# EAGLE design amirgb2vga (EAGLE 9.2.0)
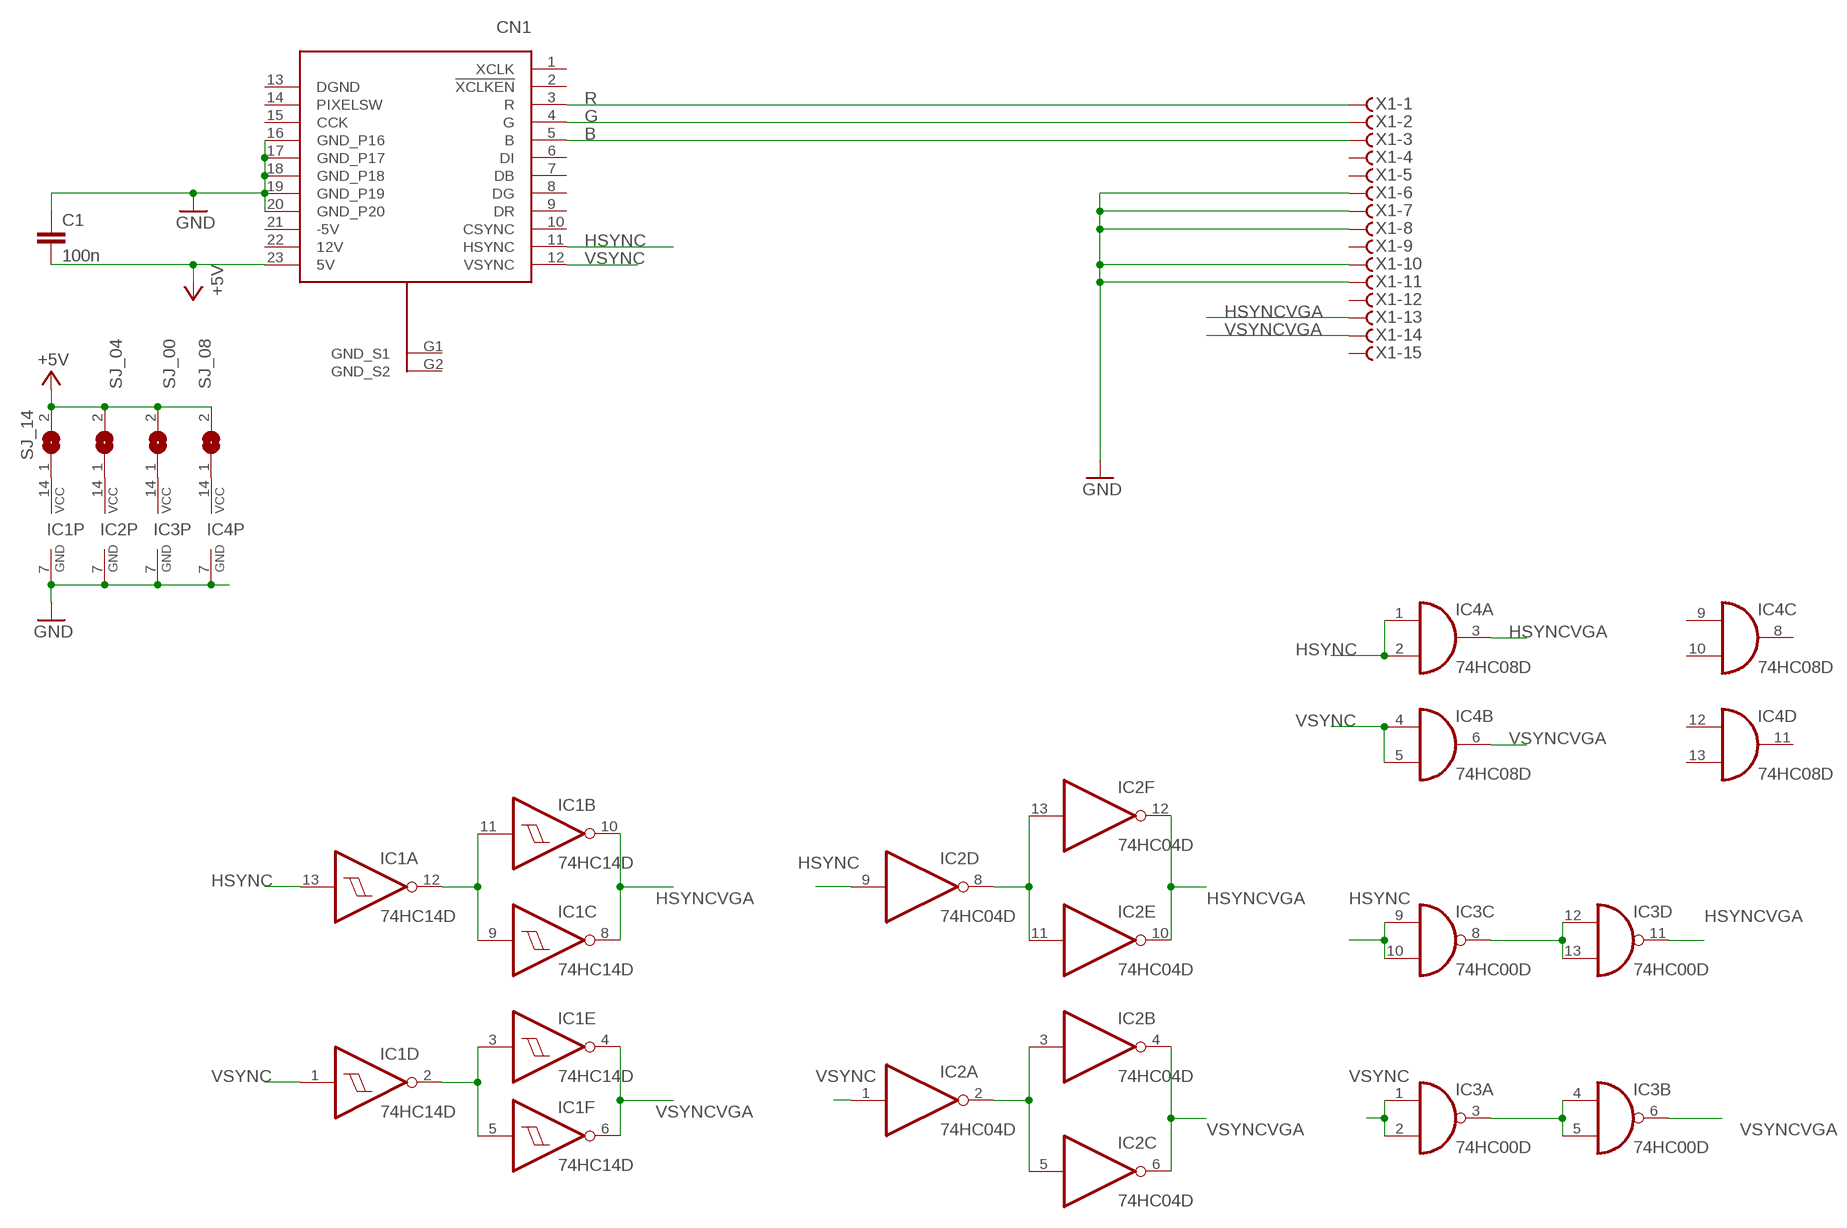
[diagram p0: schematic, sheet 1]

## Parts
C1  100n  C-EUC0805  [C0805]
CN1  VIDEO_PORT_MALE_23D_SUB_F  [F23H_FC]
IC1  74HC14D  [SO14]
IC2  74HC04D  [SO14]
IC3  74HC00D  [SO14]
IC4  74HC08D  [SO14]
SJ_00  SJ  [SJ]
SJ_04  SJ  [SJ]
SJ_08  SJ  [SJ]
SJ_14  SJ  [SJ]
X1  HF15HS  [HDF15H]

## Nets
+5V: C1.2 CN1.23(5V) SJ_00.2 SJ_04.2 SJ_08.2 SJ_14.2
B: CN1.5(B) X1.3
G: CN1.4(G) X1.2
GND: C1.1 CN1.16(GND_P16) CN1.17(GND_P17) CN1.18(GND_P18) CN1.19(GND_P19) CN1.20(GND_P20) IC1.7(P:GND) IC2.7(P:GND) IC3.7(P:GND) IC4.7(P:GND) X1.6 X1.7 X1.8 X1.10 X1.11
HSYNC: CN1.11(HSYNC) IC1.13(A:I) IC2.9(D:I) IC3.9(C:I0) IC3.10(C:I1) IC4.1(A:I0) IC4.2(A:I1)
HSYNCVGA: IC1.8(C:O) IC1.10(B:O) IC2.10(E:O) IC2.12(F:O) IC3.11(D:O) IC4.3(A:O) X1.13
N$1: IC1.14(P:VCC) SJ_14.1
N$2: IC1.2(D:O) IC1.3(E:I) IC1.5(F:I)
N$3: IC4.14(P:VCC) SJ_08.1
N$4: IC2.14(P:VCC) SJ_04.1
N$5: IC1.9(C:I) IC1.11(B:I) IC1.12(A:O)
N$6: IC3.14(P:VCC) SJ_00.1
N$8: IC2.8(D:O) IC2.11(E:I) IC2.13(F:I)
N$11: IC2.2(A:O) IC2.3(B:I) IC2.5(C:I)
N$15: IC3.8(C:O) IC3.12(D:I0) IC3.13(D:I1)
N$17: IC3.3(A:O) IC3.4(B:I0) IC3.5(B:I1)
R: CN1.3(R) X1.1
VSYNC: CN1.12(VSYNC) IC1.1(D:I) IC2.1(A:I) IC3.1(A:I0) IC3.2(A:I1) IC4.4(B:I0) IC4.5(B:I1)
VSYNCVGA: IC1.4(E:O) IC1.6(F:O) IC2.4(B:O) IC2.6(C:O) IC3.6(B:O) IC4.6(B:O) X1.14
Unconnected: CN1.1(XCLK) CN1.2(!XCLKEN!) CN1.6(DI) CN1.7(DB) CN1.8(DG) CN1.9(DR) CN1.10(CSYNC) CN1.13(DGND) CN1.14(PIXELSW) CN1.15(CCK) CN1.21(-5V) CN1.22(12V) IC4.8(C:O) IC4.9(C:I0) IC4.10(C:I1) IC4.11(D:O) IC4.12(D:I0) IC4.13(D:I1) X1.4 X1.5 X1.9 X1.12 X1.15

## Power pins joined to a net without a drawn wire
GND_S1: CN1.G1(GND_S1)
GND_S2: CN1.G2(GND_S2)

## Library data of the parts
C1 = rcl:C-EU: CAPACITOR, European symbol; SPICEPREFIX: C
CN1 = amiga:VIDEO_PORT_MALE
IC1 = 74xx-eu:74*14: Hex schmitt trigger INVERTER
IC2 = 74xx-eu:74*04: Hex INVERTER
IC3 = 74xx-eu:74*00: Quad 2-input NAND gate
IC4 = 74xx-eu:74*08: Quad 2-input AND gate
SJ_00 SJ_04 SJ_08 SJ_14 = jumper:SJ: SMD solder JUMPER
X1 = con-subd:HF15?S: SUB-D; OC_FARNELL: unknown; OC_NEWARK: unknown

## Board
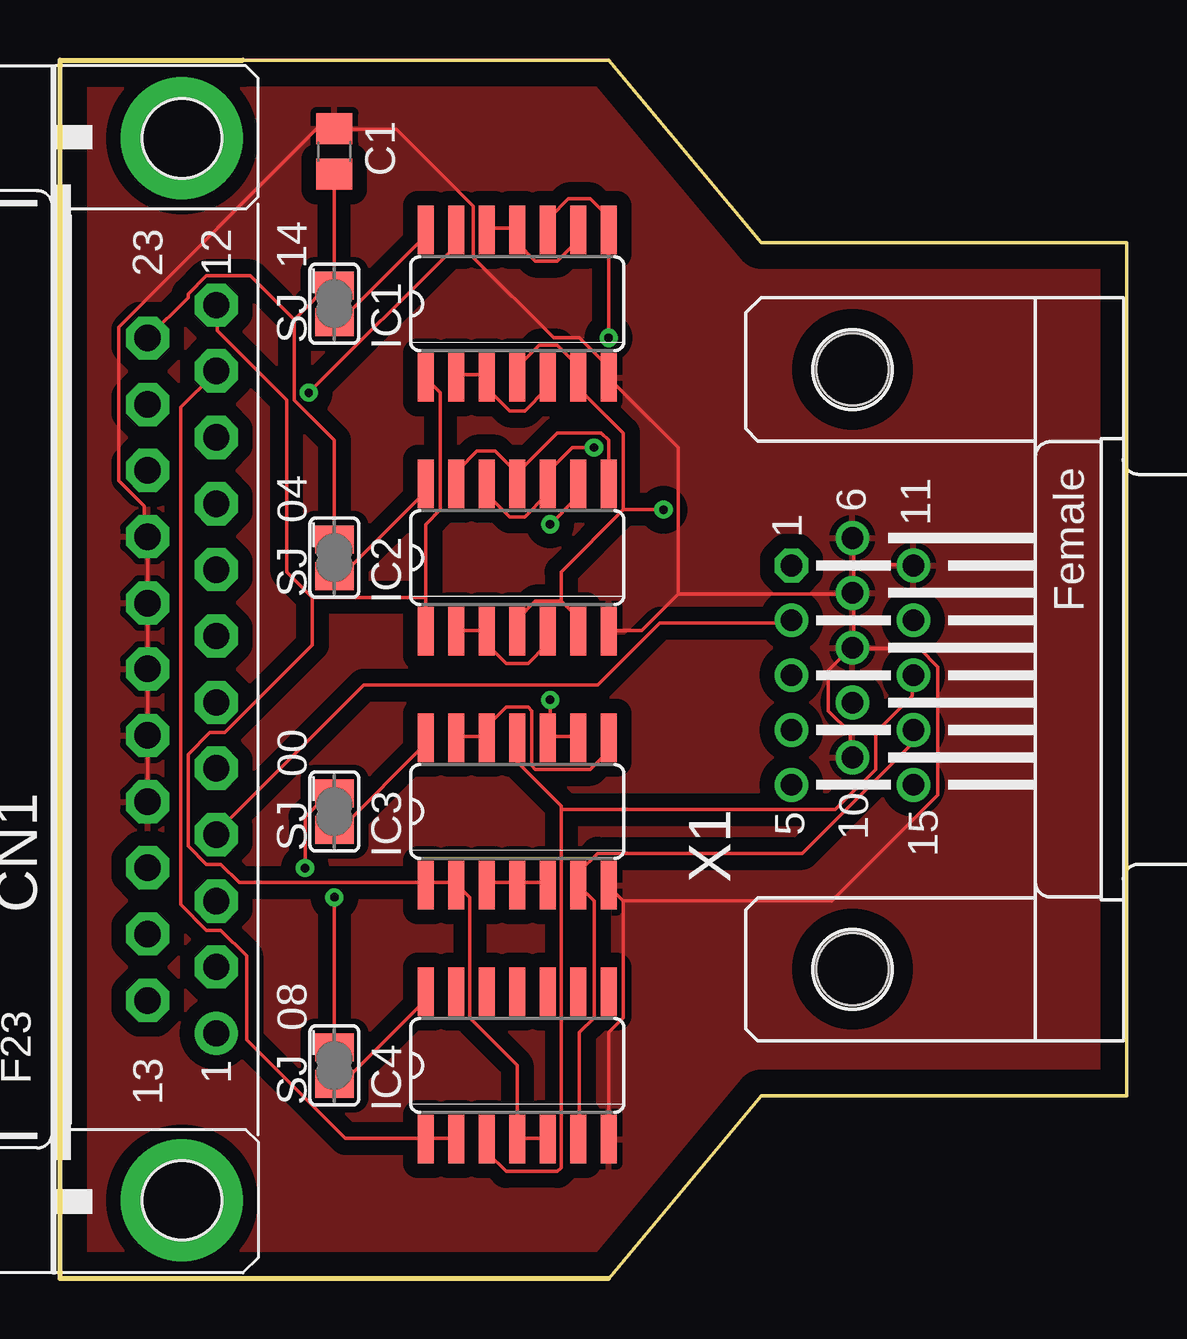
[diagram p1: board, top side]
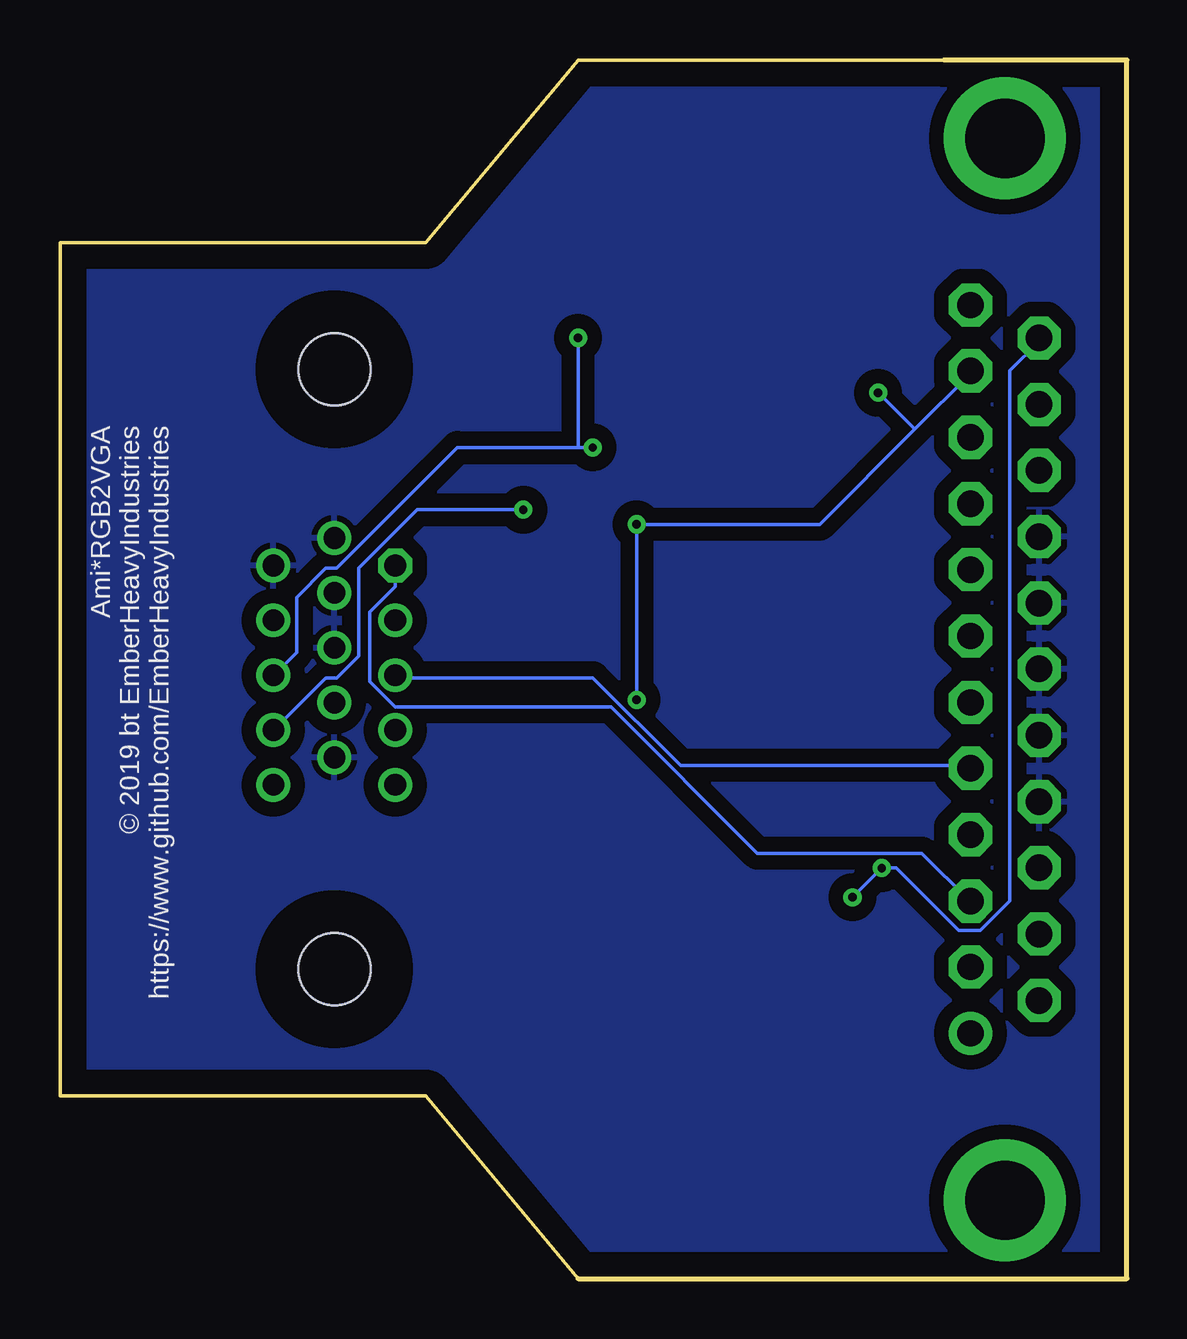
[diagram p2: board, bottom side, seen from below]

Size 44.45 x 50.8 mm. Coordinates in mm from the lower left corner, seen from the top.
Outline: 0,50.8 7.62,50.8 22.86,50.8 29.21,43.18 44.45,43.18 44.45,7.62 29.21,7.62 22.86,0 0,0 0,50.8
Copper layers (1*16): Top 0.035mm / dielectric 1.5mm / Bottom 0.035mm
Design rules "default": minimum track width 6mil, minimum drill 0.35mm, track to track 6mil, track to pad 6mil, pad to pad 6mil, via to via 6mil, smd to smd 6mil, copper to edge 40mil, drill to drill 6mil, minimum pad ring 10mil, minimum via ring 8mil, stop-mask expansion 4mil, vias tented up to drill 0mil, thermal gap 10mil

### Footprints (pad centres in the part's own frame; a part is rotated, then mirrored left to right if it is on the bottom)
C0805 = smd 1.3 x 1.5: 1 -0.95,0; 2 0.95,0
F23H_FC = drill 1.1 pad 1.8: 1 -15.172,-1.429 | drill 1.1 pad 1.8 octagon: 2 -12.403,-1.429; 3 -9.66,-1.429; 4 -6.891,-1.429; 5 -4.123,-1.429; 6 -1.38,-1.429; 7 1.389,-1.429; 8 4.158,-1.429; 9 6.901,-1.429; 10 9.669,-1.429; 11 12.438,-1.429; 12 15.181,-1.429; 13 -13.8,1.429; 14 -11.032,1.429; 15 -8.263,1.429; 16 -5.52,1.429; 17 -2.751,1.429; 18 0.017,1.429; 19 2.761,1.429; 20 5.529,1.429; 21 8.298,1.429; 22 11.041,1.429; 23 13.81,1.429 | drill 3.302 pad 5.08: G1 -22.131,0; G2 22.131,0
SO14 = smd 0.66 x 2.032: 1 -3.81,-3.073; 2 -2.54,-3.073; 3 -1.27,-3.073; 4 0,-3.073; 5 1.27,-3.073; 6 2.54,-3.073; 7 3.81,-3.073; 8 3.81,3.073; 9 2.54,3.073; 10 1.27,3.073; 11 0,3.073; 12 -1.27,3.073; 13 -2.54,3.073; 14 -3.81,3.073
SJ = smd 1.168 x 1.6: 1 -0.762,0; 2 0.762,0
HDF15H = drill 0.9 octagon: 1 4.329,2.54 | drill 0.9: 2 2.043,2.54; 3 -0.243,2.54; 4 -2.529,2.54; 5 -4.815,2.54; 6 5.472,0; 7 3.186,0; 8 0.9,0; 9 -1.386,0; 10 -3.672,0; 11 4.329,-2.54; 12 2.043,-2.54; 13 -0.243,-2.54; 14 -2.529,-2.54; 15 -4.815,-2.54 | hole 3: -12.5,0; 12.5,0

### Placement (x,y rotation side)
C1  11.43,46.99 270 top
CN1  5.08,25.4 90 top
IC1  19.05,40.64 0 top
IC2  19.05,30.06 0 top
IC3  19.05,19.47 0 top
IC4  19.05,8.89 0 top
SJ_00  11.43,19.47 90 top
SJ_04  11.43,30.06 90 top
SJ_08  11.43,8.89 90 top
SJ_14  11.43,40.64 90 top
X1  33.02,25.4 90 top

### Tracks (layer width: path | path; a pad name or v marks a point on that pad's centre or on a via)
+5V  (via drill 0.35)
  Top 0.152: v11.43,15.9 SJ_08.2 | v10.21,17.12 10.21,19.25 11.12,20.17 11.43,20.17 SJ_00.2 | 11.43,41.66 SJ_14.2 11.43,41.5 | 11.43,41.66 C1.2 | SJ_04.2 11.43,34.95 9.75,36.63 9.75,39.98 | 11.43,41.66 9.75,39.98 | 9.75,39.98 7.92,41.81 6.1,41.81 5.33,41.05 5.33,40.89 CN1.23
  Bottom 0.152: v11.43,15.9 v10.21,17.12 9.6,17.12 7.01,14.53 6.1,14.53 4.88,15.75 4.88,37.85 3.66,39.06 CN1.23
B
  Bottom 0.152: X1.3 30.48,25.04 22.25,25.04 18.59,21.39 6.55,21.39 CN1.5
G
  Top 0.152: X1.2 30.48,27.33 24.99,27.33 22.4,24.74 12.65,24.74 6.55,18.64 CN1.4
GND
  Top 0.152: IC4.7 22.86,10.26 23.47,10.87 23.47,15.75 | 23.47,15.75 22.86,16.36 IC3.7 | X1.10 32.92,21.84 32.92,22.76 32,23.67 32,25.35 32.92,26.26 X1.8 | 25.76,28.55 24.23,27.03 22.86,27.03 IC2.7 | 25.76,28.55 32.92,28.55 X1.7 | 33.07,29.77 33.07,28.7 X1.7 | 33.07,29.77 33.07,30.84 X1.6 | 33.07,29.77 35.51,29.77 X1.11 | X1.8 33.07,26.42 33.07,28.55 X1.7 | 23.47,15.75 32.16,15.75 36.58,20.17 36.58,25.5 35.81,26.26 33.07,26.26 X1.8 | CN1.16 3.66,20.02 3.66,22.61 CN1.17 3.66,22.76 3.66,25.35 CN1.18 3.66,25.5 3.66,28.09 CN1.19 3.66,28.24 3.66,30.84 CN1.20 3.5,30.99 3.5,32.21 2.44,33.27 2.44,39.67 10.67,47.9 11.43,47.9 | 11.43,47.9 14.02,47.9 17.22,44.7 17.22,42.57 20.57,39.22 21.64,39.22 22.86,38 IC1.7 22.86,37.54 25.76,34.65 25.76,28.55 | 11.43,47.9 C1.1
  pour Bottom (isolate 0.61): 0,50.8 22.86,50.8 29.21,43.18 44.45,43.18 44.45,7.62 29.21,7.62 22.86,0 0,0
  pour Top (isolate 0.61): 0,50.8 22.86,50.8 29.21,43.18 44.45,43.18 44.45,7.62 29.21,7.62 22.86,0 0,0
HSYNC  (via drill 0.35)
  Top 0.152: 20.42,22.61 21.49,22.61 IC3.9 | 15.24,5.84 16.46,5.84 IC4.2 | v20.42,31.45 21.49,32.51 21.49,33.12 IC2.9 | v10.36,36.93 16.46,43.03 16.46,43.64 IC1.13 | 15.24,5.84 11.89,5.84 7.77,9.96 7.77,13.46 6.71,14.53 6.1,14.53 5.03,15.6 5.03,36.32 6.4,37.69 CN1.11 | 15.24,5.84 IC4.1 | v20.42,24.13 20.42,22.61 | 20.42,22.61 IC3.10
  Bottom 0.152: 8.84,35.41 6.55,37.69 CN1.11 | 8.84,35.41 12.8,31.45 v20.42,31.45 v20.42,24.13 | 8.84,35.41 v10.36,36.93
HSYNCVGA  (via drill 0.35)
  Top 0.152: IC1.10 20.42,43.79 20.42,44.25 21.18,45.01 22.1,45.01 22.86,44.25 IC1.8 v22.86,39.22 | IC2.12 17.83,33.12 17.83,32.66 18.75,31.75 19.36,31.75 20.27,32.66 20.27,33.12 IC2.10 20.42,33.27 20.42,33.73 21.34,34.65 v22.25,34.65 | 20.88,19.56 20.88,19.71 19.05,21.54 IC3.11 | 20.88,19.56 20.88,4.62 20.73,4.47 18.59,4.47 17.83,5.23 17.83,5.69 IC4.3 | 20.88,19.56 32.31,19.56 33.98,21.23 33.98,22.76 35.51,24.28 35.51,25.04 X1.13
  Bottom 0.152: 22.86,34.65 27.89,34.65 32.92,29.62 33.38,29.62 34.59,28.4 34.59,26.11 35.51,25.2 X1.13 | 22.86,34.65 v22.25,34.65 | 22.86,34.65 v22.86,39.22
N$1
  Top 0.152: IC1.14 15.24,43.48 11.73,39.98 11.43,39.98 SJ_14.1
N$2
  Top 0.152: IC1.2 16.61,37.69 17.68,37.69 IC1.3 17.83,37.54 17.83,37.08 18.75,36.17 19.36,36.17 20.27,37.08 20.27,37.54 IC1.5
N$3
  Top 0.152: SJ_08.1 11.73,8.13 15.24,11.63 IC4.14
N$4
  Top 0.152: IC2.14 15.24,32.82 11.73,29.31 11.43,29.31 SJ_04.1
N$5
  Top 0.152: IC1.12 17.83,43.79 19.05,43.79 IC1.11 19.05,43.18 19.81,42.42 20.73,42.42 21.49,43.18 21.49,43.64 IC1.9
N$6
  Top 0.152: IC3.14 15.24,22.3 11.73,18.8 11.43,18.8 SJ_00.1
N$8
  Top 0.152: 19.05,33.58 18.14,34.49 17.37,34.49 16.61,33.73 16.61,33.27 IC2.13 | 19.05,33.58 IC2.11 19.05,33.27 | IC2.8 22.86,34.95 22.55,35.25 20.73,35.25 19.05,33.58
N$11
  Top 0.152: IC2.2 16.61,27.03 17.68,27.03 IC2.3 17.83,26.87 17.83,26.42 18.59,25.65 19.51,25.65 20.27,26.42 20.27,26.87 IC2.5
N$15
  Top 0.152: IC3.13 16.61,22.61 17.68,22.61 IC3.12 17.83,22.61 17.83,23.06 18.59,23.82 19.51,23.82 19.66,23.67 19.66,21.39 19.81,21.23 22.1,21.23 22.86,22 IC3.8
N$17
  Top 0.152: 19.05,16.51 17.83,16.51 IC3.3 | 19.05,16.51 20.27,16.51 IC3.5 | 19.05,16.51 IC3.4
R
  Bottom 0.152: X1.1 30.48,28.85 31.55,27.79 31.55,24.89 30.48,23.82 21.49,23.82 15.39,17.73 8.53,17.73 6.55,15.75 CN1.3
VSYNC
  Top 0.152: 19.05,5.84 20.27,5.84 IC4.5 | 15.24,16.51 16.46,16.51 IC3.2 16.61,16.36 17.07,15.9 17.07,10.87 19.05,8.89 19.05,5.84 | 19.05,5.84 IC4.4 | 15.24,28.4 15.24,31.45 15.85,32.05 15.85,36.93 15.24,37.54 IC1.1 | 15.24,28.4 IC2.1 | 10.52,28.4 9.45,29.46 9.45,36.63 6.55,39.52 6.55,40.44 CN1.12 | 15.24,28.4 10.52,28.4 | 15.24,16.51 7.47,16.51 6.71,17.27 6.1,17.27 5.33,18.03 5.33,21.84 6.25,22.76 6.86,22.76 10.52,26.42 10.52,28.4 | 15.24,16.51 IC3.1
VSYNCVGA  (via drill 0.35)
  Top 0.152: IC2.4 19.05,27.48 19.81,28.24 20.88,28.24 | 20.88,28.24 21.49,27.63 21.49,27.03 IC2.6 | IC1.4 19.05,38 19.96,38.91 20.73,38.91 21.49,38.15 21.49,37.69 IC1.6 21.64,37.54 21.64,37.08 23.47,35.25 23.47,32.05 | 20.88,28.24 20.88,29.46 23.47,32.05 | IC4.6 21.64,5.84 21.64,10.26 22.25,10.87 22.25,15.75 21.64,16.36 IC3.6 21.64,16.51 21.64,16.97 22.4,17.73 30.94,17.73 35.51,22.3 35.51,22.76 X1.14 | v25.15,32.05 23.47,32.05
  Bottom 0.152: v25.15,32.05 29.57,32.05 32,29.62 32,25.96 32.92,25.04 33.38,25.04 35.51,22.91 X1.14

### Text on the board
bPlace: Ami*RGB2VGA / © 2019 bt EmberHeavyIndustries / https://www.github.com/EmberHeavyIndustries
_tNames: C2 | X2 | V3 | CN2 | X1 | C1 | V1 | CN1